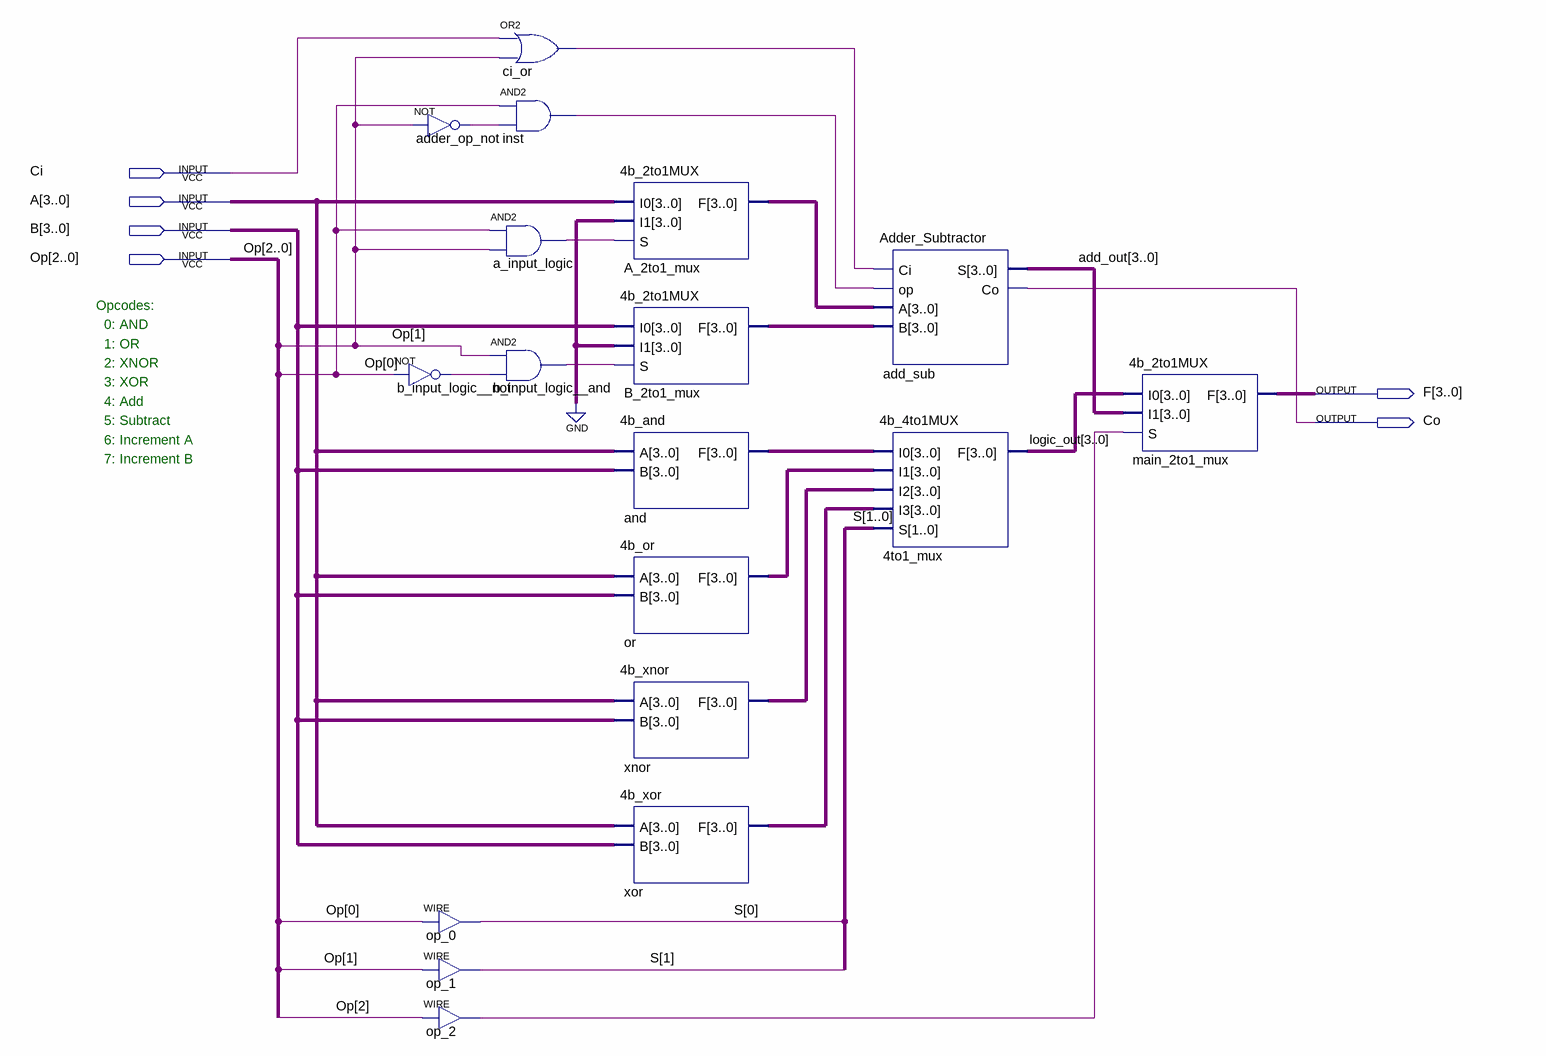
[diagram p0: schematic sheet]
// Quartus schematic ALU.bdf as structural Verilog: 18 symbols, 6 pins
module ALU (
  input  Ci,
  input  [3:0] A,
  input  [3:0] B,
  input  [2:0] Op,
  output [3:0] F,
  output Co
);

  wire a_input_logic_out, adder_op_not_out, b_input_logic__and_out, b_input_logic__not_out, ci_or_out,
       inst_out, op_2_out;
  wire [1:0] S;
  wire [3:0] A_2to1_mux_f, add_out, and_f, B_2to1_mux_f, logic_out, or_f, xnor_f, xor_f;

  not adder_op_not (adder_op_not_out, Op[1]);
  not b_input_logic__not (b_input_logic__not_out, Op[0]);
  assign S[0] = Op[0];  // WIRE op_0
  assign S[1] = Op[1];  // WIRE op_1
  assign op_2_out = Op[2];  // WIRE op_2
  or ci_or (ci_or_out, Ci, Op[1]);
  and inst (inst_out, Op[0], adder_op_not_out);
  and a_input_logic (a_input_logic_out, Op[0], Op[1]);
  and b_input_logic__and (b_input_logic__and_out, Op[1], b_input_logic__not_out);
  \4b_2to1MUX  A_2to1_mux (.I0(A), .I1(4'b0000), .S(a_input_logic_out), .F(A_2to1_mux_f));
  \4b_2to1MUX  B_2to1_mux (.I0(B), .I1(4'b0000), .S(b_input_logic__and_out), .F(B_2to1_mux_f));
  \4b_and  \and  (.A(A), .B(B), .F(and_f));
  \4b_or  \or  (.A(A), .B(B), .F(or_f));
  \4b_xnor  \xnor  (.A(A), .B(B), .F(xnor_f));
  \4b_xor  \xor  (.A(A), .B(B), .F(xor_f));
  Adder_Subtractor add_sub (.Ci(ci_or_out), .op(inst_out), .A(A_2to1_mux_f), .B(B_2to1_mux_f), .S(add_out), .Co(Co));
  \4b_4to1MUX  u_4to1_mux (.I0(and_f), .I1(or_f), .I2(xnor_f), .I3(xor_f), .S(S), .F(logic_out));
  \4b_2to1MUX  main_2to1_mux (.I0(logic_out), .I1(add_out), .S(op_2_out), .F(F));

  // Notes on the sheet:
  //   Opcodes:
  //     0: AND
  //     1: OR
  //     2: XNOR
  //     3: XOR
  //     4: Add
  //     5: Subtract
  //     6: Increment A
  //     7: Increment B
endmodule
